# EAGLE schematic V3_slice_noshift (EAGLE 6.5.0)

## Sheet 1 of 6
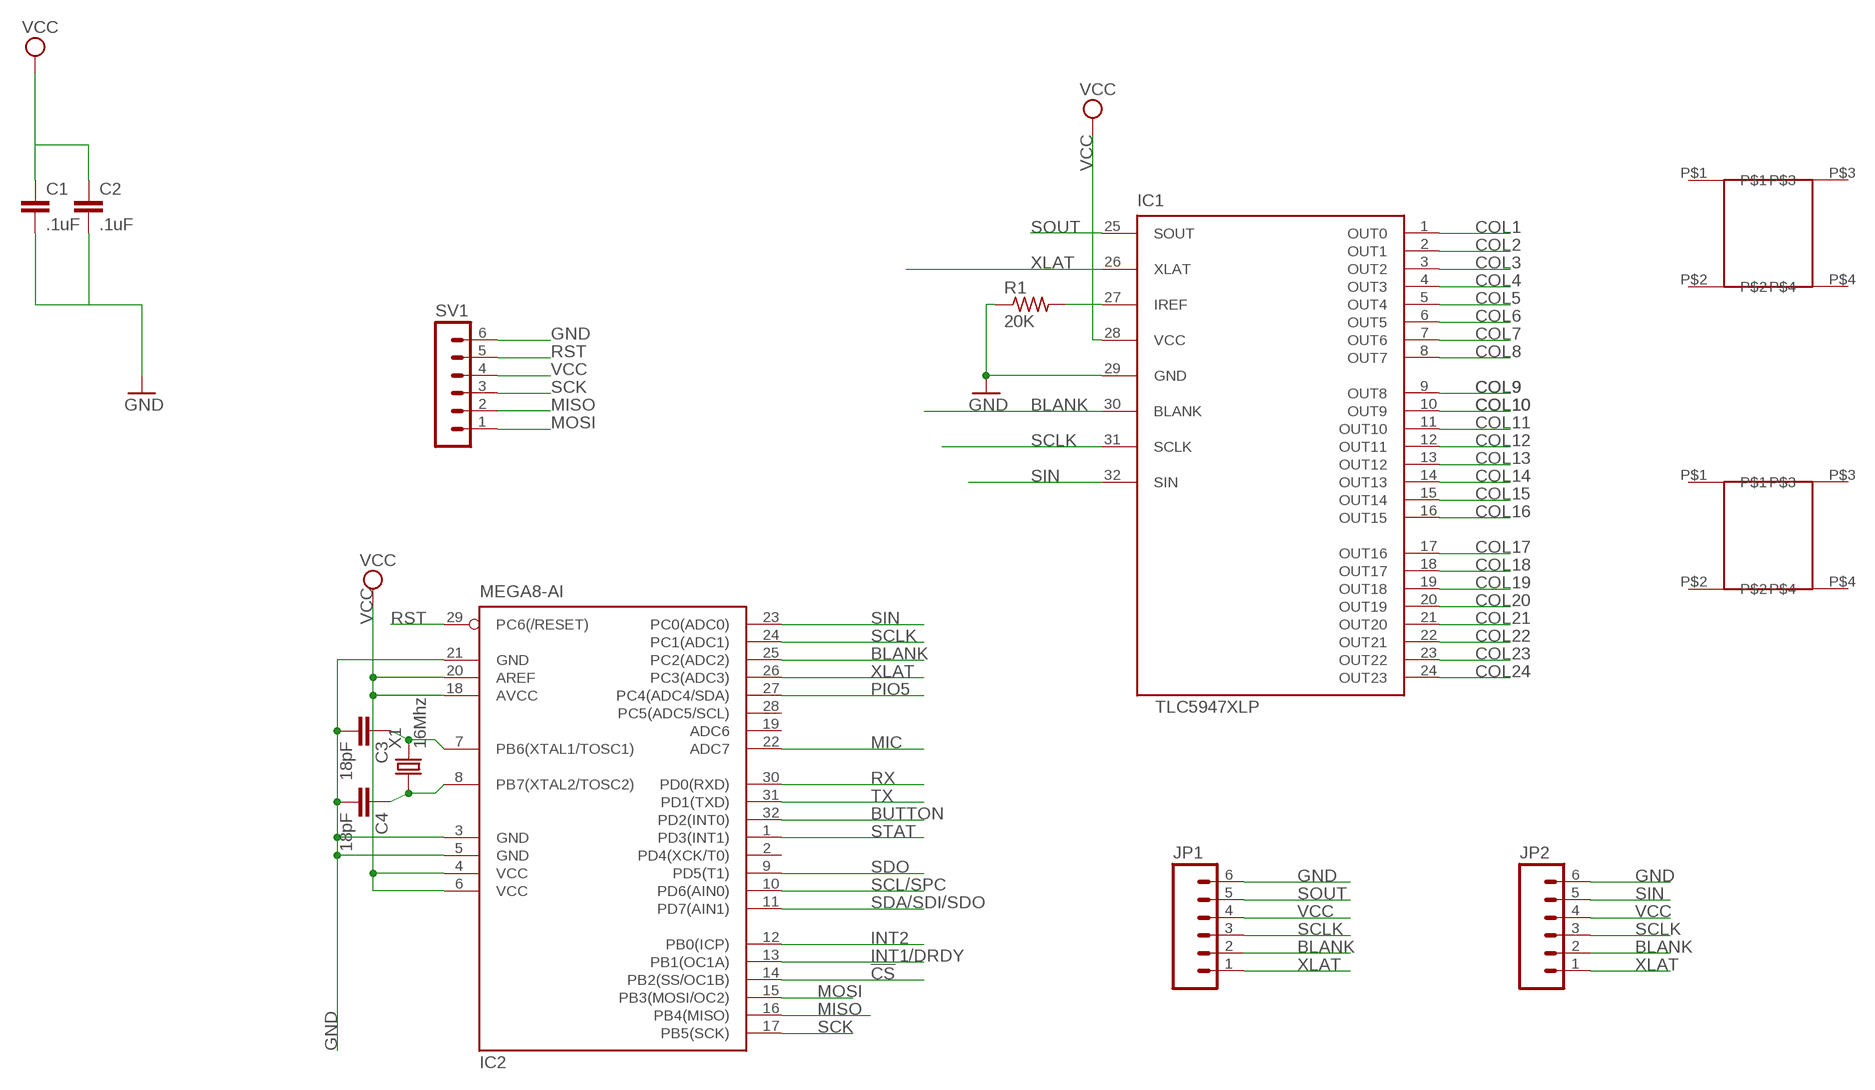
[diagram p0: schematic, sheet 1]

### Parts
C1  .1uF  CAP0805  [0805]
C2  .1uF  CAP0805  [0805]
C3  18pF  CAP0805  [0805]
C4  18pF  CAP0805  [0805]
IC1  TLC5947XLP  [QFN32_XLP]
IC2  MEGA8-AI  [TQFP32-08]
JP1  M061X06-SMD_EDGE_FEMALE  [1X06-SMD_EDGE]
JP2  M061X06-SMD_EDGE_FEMALE  [1X06-SMD_EDGE]
R1  20K  R-US_R0805  [R0805]
SLOT1  SLOT  [SLOT]
SLOT2  SLOT  [SLOT]
SV1  MA06-1  [MA06-1]
X1  16Mhz  CRYSTAL-5032  [5032]

### Nets
!CS: IC2.14(PB2(SS/OC1B)) ; also sheet 3
BLANK: IC1.30(BLANK) IC2.25(PC2(ADC2)) JP1.2 JP2.2
BUTTON: IC2.32(PD2(INT0)) ; also sheet 3
COL1: IC1.1(OUT0) ; also sheet 2
COL2: IC1.2(OUT1) ; also sheet 2
COL3: IC1.3(OUT2) ; also sheet 2
COL4: IC1.4(OUT3) ; also sheet 2
COL5: IC1.5(OUT4) ; also sheet 2
COL6: IC1.6(OUT5) ; also sheet 2
COL7: IC1.7(OUT6) ; also sheet 2
COL8: IC1.8(OUT7) ; also sheet 2
COL9: IC1.9(OUT8) ; also sheet 2
COL10: IC1.10(OUT9) ; also sheet 2
COL11: IC1.11(OUT10) ; also sheet 2
COL12: IC1.12(OUT11) ; also sheet 2
COL13: IC1.13(OUT12) ; also sheet 2
COL14: IC1.14(OUT13) ; also sheet 2
COL15: IC1.15(OUT14) ; also sheet 2
COL16: IC1.16(OUT15) ; also sheet 2
COL17: IC1.17(OUT16) ; also sheet 2
COL18: IC1.18(OUT17) ; also sheet 2
COL19: IC1.19(OUT18) ; also sheet 2
COL20: IC1.20(OUT19) ; also sheet 2
COL21: IC1.21(OUT20) ; also sheet 2
COL22: IC1.22(OUT21) ; also sheet 2
COL23: IC1.23(OUT22) ; also sheet 2
COL24: IC1.24(OUT23) ; also sheet 2
GND: C1.2 C2.2 C3.2 C4.2 IC1.29(GND) IC2.3(GND) IC2.5(GND) IC2.21(GND) JP1.6 JP2.6 R1.1 SV1.6 ; also sheet 3,4,5,6
INT1/DRDY: IC2.13(PB1(OC1A)) ; also sheet 3
INT2: IC2.12(PB0(ICP)) ; also sheet 3
MIC: IC2.22(ADC7) ; also sheet 6
MISO: IC2.16(PB4(MISO)) SV1.2
MOSI: IC2.15(PB3(MOSI/OC2)) SV1.1
N$7: C3.1 IC2.7(PB6(XTAL1/TOSC1)) X1.2
N$8: C4.1 IC2.8(PB7(XTAL2/TOSC2)) X1.1
N$13: IC1.27(IREF) R1.2
PIO5: IC2.27(PC4(ADC4/SDA)) ; also sheet 5
RST: IC2.29(PC6(/RESET)) SV1.5 ; also sheet 3,5
RX: IC2.30(PD0(RXD)) ; also sheet 5
SCK: IC2.17(PB5(SCK)) SV1.3
SCL/SPC: IC2.10(PD6(AIN0)) ; also sheet 3
SCLK: IC1.31(SCLK) IC2.24(PC1(ADC1)) JP1.3 JP2.3
SDA/SDI/SDO: IC2.11(PD7(AIN1)) ; also sheet 3
SDO: IC2.9(PD5(T1)) ; also sheet 3
SIN: IC1.32(SIN) IC2.23(PC0(ADC0)) JP2.5
SOUT: IC1.25(SOUT) JP1.5
STAT: IC2.1(PD3(INT1)) ; also sheet 4
TX: IC2.31(PD1(TXD)) ; also sheet 5
VCC: C1.1 C2.1 IC1.28(VCC) IC2.4(VCC) IC2.6(VCC) IC2.18(AVCC) IC2.20(AREF) JP1.4 JP2.4 SV1.4 ; also sheet 2,3,4,5,6
XLAT: IC1.26(XLAT) IC2.26(PC3(ADC3)) JP1.1 JP2.1
Unconnected: IC2.2(PD4(XCK/T0)) IC2.19(ADC6) IC2.28(PC5(ADC5/SCL)) SLOT1.P$1 SLOT1.P$2 SLOT1.P$3 SLOT1.P$4 SLOT2.P$1 SLOT2.P$2 SLOT2.P$3 SLOT2.P$4

## Sheet 2 of 6
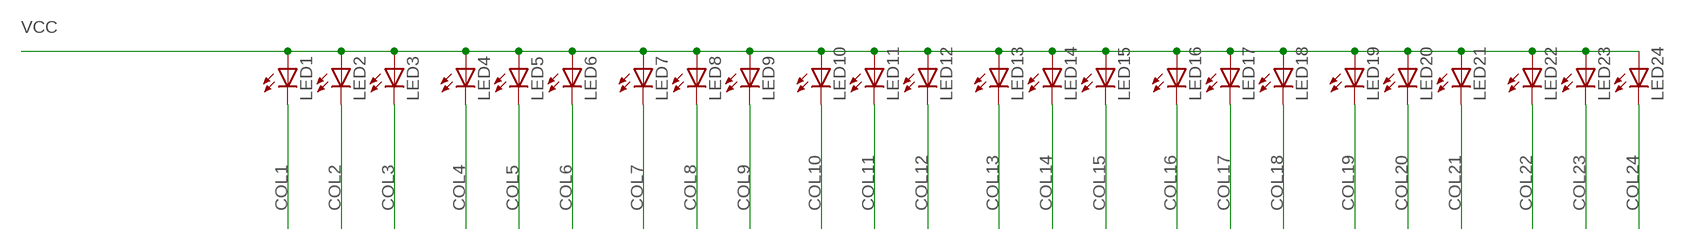
[diagram p1: schematic, sheet 2]

### Parts
LED1  LEDIRL80A  [IRL80A]
LED2  LEDIRL80A  [IRL80A]
LED3  LEDIRL80A  [IRL80A]
LED4  LEDIRL80A  [IRL80A]
LED5  LEDIRL80A  [IRL80A]
LED6  LEDIRL80A  [IRL80A]
LED7  LEDIRL80A  [IRL80A]
LED8  LEDIRL80A  [IRL80A]
LED9  LEDIRL80A  [IRL80A]
LED10  LEDIRL80A  [IRL80A]
LED11  LEDIRL80A  [IRL80A]
LED12  LEDIRL80A  [IRL80A]
LED13  LEDIRL80A  [IRL80A]
LED14  LEDIRL80A  [IRL80A]
LED15  LEDIRL80A  [IRL80A]
LED16  LEDIRL80A  [IRL80A]
LED17  LEDIRL80A  [IRL80A]
LED18  LEDIRL80A  [IRL80A]
LED19  LEDIRL80A  [IRL80A]
LED20  LEDIRL80A  [IRL80A]
LED21  LEDIRL80A  [IRL80A]
LED22  LEDIRL80A  [IRL80A]
LED23  LEDIRL80A  [IRL80A]
LED24  LEDIRL80A  [IRL80A]

### Nets
COL1: LED1.K(C) ; also sheet 1
COL2: LED2.K(C) ; also sheet 1
COL3: LED3.K(C) ; also sheet 1
COL4: LED4.K(C) ; also sheet 1
COL5: LED5.K(C) ; also sheet 1
COL6: LED6.K(C) ; also sheet 1
COL7: LED7.K(C) ; also sheet 1
COL8: LED8.K(C) ; also sheet 1
COL9: LED9.K(C) ; also sheet 1
COL10: LED10.K(C) ; also sheet 1
COL11: LED11.K(C) ; also sheet 1
COL12: LED12.K(C) ; also sheet 1
COL13: LED13.K(C) ; also sheet 1
COL14: LED14.K(C) ; also sheet 1
COL15: LED15.K(C) ; also sheet 1
COL16: LED16.K(C) ; also sheet 1
COL17: LED17.K(C) ; also sheet 1
COL18: LED18.K(C) ; also sheet 1
COL19: LED19.K(C) ; also sheet 1
COL20: LED20.K(C) ; also sheet 1
COL21: LED21.K(C) ; also sheet 1
COL22: LED22.K(C) ; also sheet 1
COL23: LED23.K(C) ; also sheet 1
COL24: LED24.K(C) ; also sheet 1
VCC: LED1.A LED2.A LED3.A LED4.A LED5.A LED6.A LED7.A LED8.A LED9.A LED10.A LED11.A LED12.A LED13.A LED14.A LED15.A LED16.A LED17.A LED18.A LED19.A LED20.A LED21.A LED22.A LED23.A LED24.A ; also sheet 1,3,4,5,6

## Sheet 3 of 6
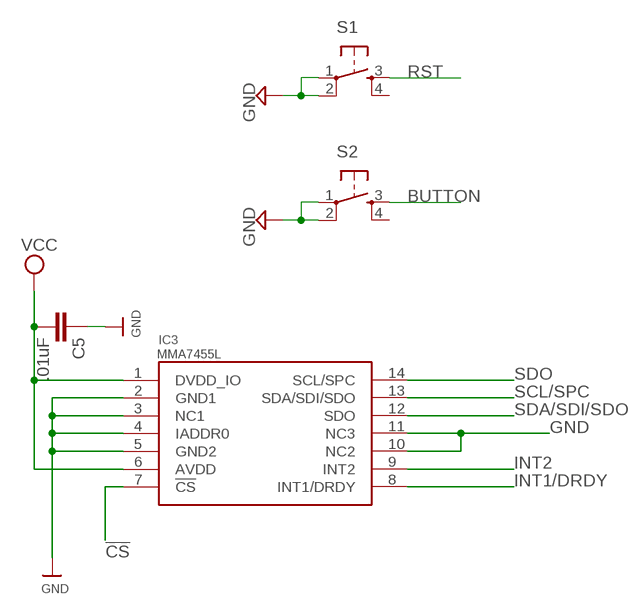
[diagram p2: schematic, sheet 3]

### Parts
C5  .01uF  CAP0805  [0805]
IC3  MMA7455L  [LGA-14]
S1  TAC_SWITCHSMD  [TACTILE_SWITCH_SMD]
S2  TAC_SWITCHSMD  [TACTILE_SWITCH_SMD]

### Nets
!CS: IC3.7(!CS) ; also sheet 1
BUTTON: S2.3 ; also sheet 1
GND: C5.1 IC3.2(GND1) IC3.3(NC1) IC3.4(IADDR0) IC3.5(GND2) IC3.10(NC2) IC3.11(NC3) S1.1 S1.2 S2.1 S2.2 ; also sheet 1,4,5,6
INT1/DRDY: IC3.8(INT1/DRDY) ; also sheet 1
INT2: IC3.9(INT2) ; also sheet 1
RST: S1.3 ; also sheet 1,5
SCL/SPC: IC3.13(SDA/SDI/SDO) ; also sheet 1
SDA/SDI/SDO: IC3.12(SDO) ; also sheet 1
SDO: IC3.14(SCL/SPC) ; also sheet 1
VCC: C5.2 IC3.1(DVDD_IO) IC3.6(AVDD) ; also sheet 1,2,4,5,6
Unconnected: S1.4 S2.4

## Sheet 4 of 6
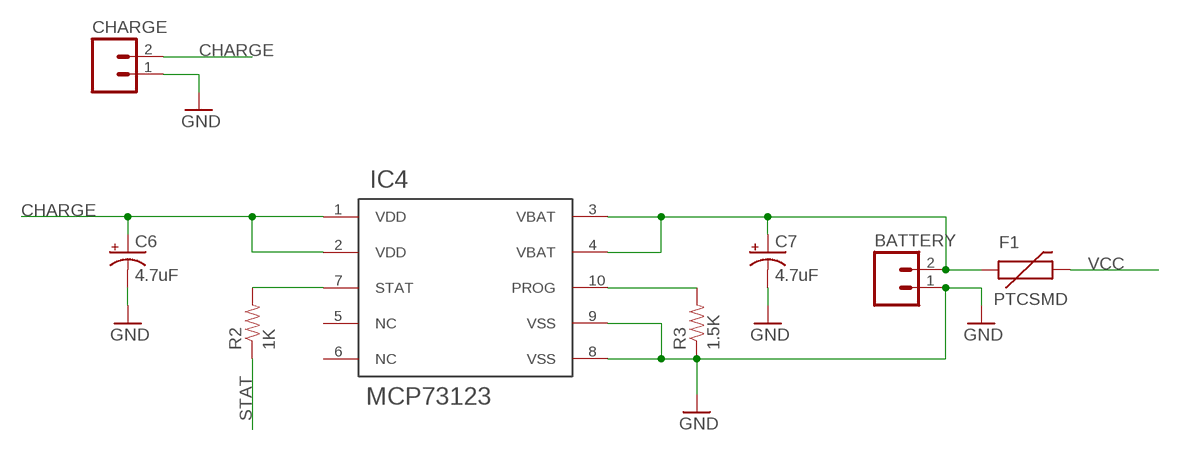
[diagram p3: schematic, sheet 4]

### Parts
BATTERY  M02PTH  [1X02]
C6  4.7uF  CAP_POL3528  [EIA3528]
C7  4.7uF  CAP_POL3528  [EIA3528]
CHARGE  M02-JST-2-PTH-NO_SILK  [JST-2-PTH-NS]
F1  PTCSMD  [PTC-1206]
IC4  MCP73123  [DFN10_3X3]
R2  1K  RESISTOR0805  [0805]
R3  1.5K  RESISTOR0805  [0805]

### Nets
CHARGE: C6.A(+) CHARGE.2 IC4.1(VDD) IC4.2(VDD)
GND: BATTERY.1 C6.C(-) C7.C(-) CHARGE.1 IC4.8(VSS) IC4.9(VSS) R3.1 ; also sheet 1,3,5,6
N$1: IC4.7(STAT) R2.2
N$6: IC4.10(PROG) R3.2
STAT: R2.1 ; also sheet 1
VBAT: BATTERY.2 C7.A(+) F1.1 IC4.3(VBAT) IC4.4(VBAT)
VCC: F1.2 ; also sheet 1,2,3,5,6
Unconnected: IC4.5(NC) IC4.6(NC)

## Sheet 5 of 6
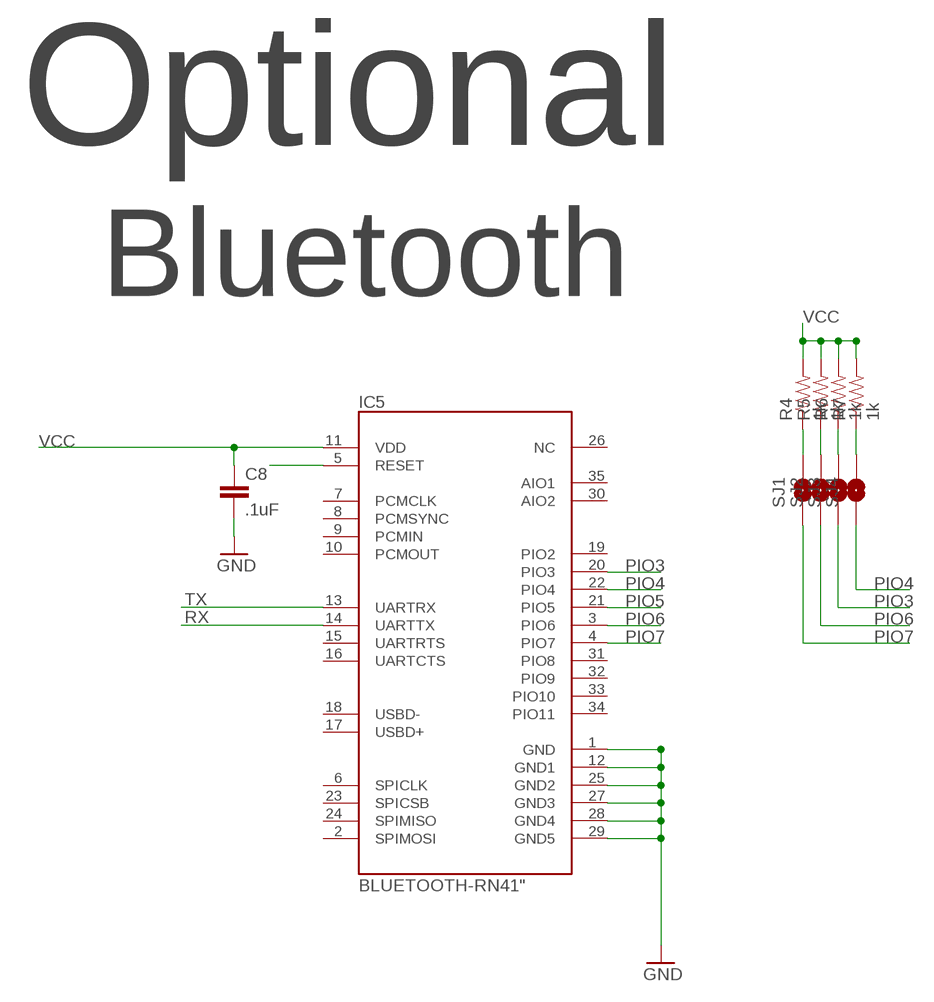
[diagram p4: schematic, sheet 5]

### Parts
C8  .1uF  CAP0805  [0805]
IC5  BLUETOOTH-RN41"  [RN41]
R4  1k  RESISTOR  [0805]
R5  1k  RESISTOR  [0805]
R6  1k  RESISTOR  [0805]
R7  1k  RESISTOR  [0805]
SJ1  SOLDERJUMPERNO  [SJ_2S-NO]
SJ2  SOLDERJUMPERNO  [SJ_2S-NO]
SJ3  SOLDERJUMPERNO  [SJ_2S-NO]
SJ4  SOLDERJUMPERNO  [SJ_2S-NO]

### Nets
GND: C8.2 IC5.1(GND) IC5.12(GND1) IC5.25(GND2) IC5.27(GND3) IC5.28(GND4) IC5.29(GND5) ; also sheet 1,3,4,6
N$5: R4.1 SJ1.2
N$21: R6.1 SJ3.2
N$23: R5.1 SJ2.2
N$24: R7.1 SJ4.2
PIO3: IC5.20(PIO3) SJ3.1
PIO4: IC5.22(PIO4) SJ4.1
PIO5: IC5.21(PIO5) ; also sheet 1
PIO6: IC5.3(PIO6) SJ2.1
PIO7: IC5.4(PIO7) SJ1.1
RST: IC5.5(RESET) ; also sheet 1,3
RX: IC5.14(UARTTX) ; also sheet 1
TX: IC5.13(UARTRX) ; also sheet 1
VCC: C8.1 IC5.11(VDD) R4.2 R5.2 R6.2 R7.2 ; also sheet 1,2,3,4,6
Unconnected: IC5.2(SPIMOSI) IC5.6(SPICLK) IC5.7(PCMCLK) IC5.8(PCMSYNC) IC5.9(PCMIN) IC5.10(PCMOUT) IC5.15(UARTRTS) IC5.16(UARTCTS) IC5.17(USBD+) IC5.18(USBD-) IC5.19(PIO2) IC5.23(SPICSB) IC5.24(SPIMISO) IC5.26(NC) IC5.30(AIO2) IC5.31(PIO8) IC5.32(PIO9) IC5.33(PIO10) IC5.34(PIO11) IC5.35(AIO1)

### Notes on the sheet
- Optional
- Bluetooth

## Sheet 6 of 6
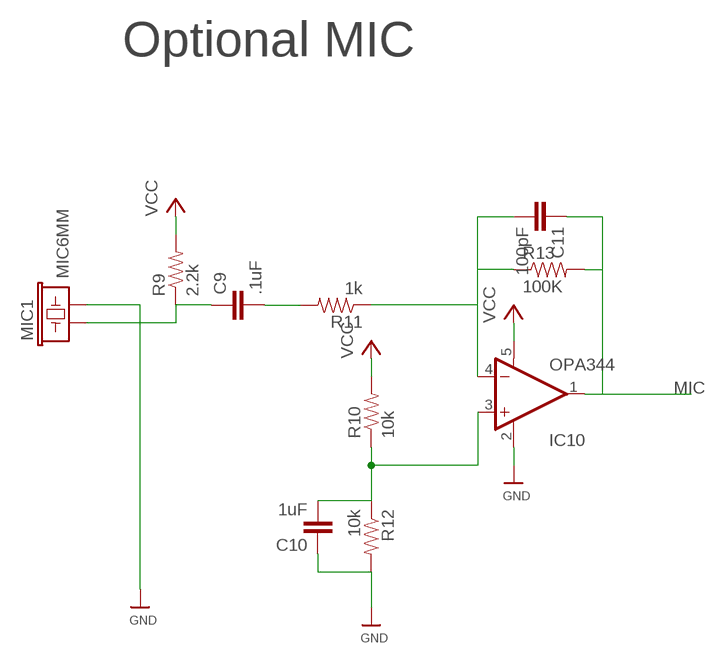
[diagram p5: schematic, sheet 6]

### Parts
C9  .1uF  CAP0805  [0805]
C10  1uF  CAP0805  [0805]
C11  100pF  CAP0805  [0805]
IC10  OPA344  [SOT23-5]
MIC1  MIC6MM  [MIC-6MM]
R9  2.2k  RESISTOR  [0805]
R10  10k  RESISTOR  [0805]
R11  1k  RESISTOR  [0805]
R12  10k  RESISTOR  [0805]
R13  100K  RESISTOR  [0805]

### Nets
GND: C10.1 IC10.2(V-) MIC1.2 R12.2 ; also sheet 1,3,4,5
MIC: C11.1 IC10.1(OUT) R13.2 ; also sheet 1
N$3: C9.2 R11.2
N$10: C11.2 IC10.4(-IN) R11.1 R13.1
N$11: C9.1 MIC1.1 R9.1
N$12: C10.2 IC10.3(+IN) R10.1 R12.1
VCC: IC10.5(V+) R9.2 R10.2 ; also sheet 1,2,3,4,5

### Notes on the sheet
- Optional MIC

## Library data of the parts
BATTERY CHARGE = SparkFun:M02: Header 2 Standard 2-pin 0.1" header. Use with straight break away headers (SKU : PRT-00116), right angle break away headers (PRT-00553), swiss pins (PRT-00743), machine pins (PRT-00117), and female headers (PRT-00115). Molex polarized connector foot print use with SKU : PRT-08233 with associated crimp pins and housings.
C1-C4 = slice_noshift:CAP: Capacitor Standard 0603 ceramic capacitor, and 0.1" leaded capacitor.
C5 C8-C11 = SparkFun:CAP: Capacitor Standard 0603 ceramic capacitor, and 0.1" leaded capacitor.
C6 C7 = slice_noshift:CAP_POL: Capacitor Polarized These are standard SMD and PTH capacitors. Normally 10uF, 47uF, and 100uF in electrolytic and tantalum varieties. Always verify the external diameter of the through hole cap, it varies with capacity, voltage, and manufacturer. The EIA devices should be standard.
F1 = SparkFun:PTC: Resettable Fuse PTC Resettable Fuse. Spark Fun Electronics SKU : COM-08357
IC1 = slice_noshift:TLC5947
IC2 = atmel:MEGA8: MICROCONTROLLER 8 Kbytes FLASH, 1 kbytes SRAM, 512 bytes EEPROM, USART, 6-channel 10 bit ADC, 2-channel 8 bit ADC Pin compatible with Atmega48, ATMega88, ATMega168 Source: avr.lbr; MPN: ATMEGA8-16AU; OC_FARNELL: 9171371; OC_NEWARK: 73M8863
IC3 = MMA7455Lbreakoutboard-v1a:MMA7455L
IC4 = V3_slice_noshift:MCP73123
IC5 = NSL_Mini_Quad:BLUETOOTH-RN41
IC10 = SparkFun:OPA344
JP1 JP2 = SparkFun:M06: Header 6 Standard 6-pin 0.1" header. Use with straight break away headers (SKU : PRT-00116), right angle break away headers (PRT-00553), swiss pins (PRT-00743), machine pins (PRT-00117), and female headers (PRT-00115). Molex polarized connector foot print use with SKU : PRT-08094 with associated crimp pins and housings. NOTES ON THE VARIANTS LOCK and LOCK_LONGPADS... This footprint was designed to help hold the alignment of a through-hole component (i.e. 6-pin header) while soldering it into place. You may notice that each hole has been shifted either up or down by 0.005 of an inch from it's more standard position (which is a perfectly straight line). This slight alteration caused the pins (the squares in the middle) to touch the edges of the holes. Because they are alternating, it causes a "brace" to hold the component in place. 0.005 has proven to be the perfect amount of "off-center" position when using our standard breakaway headers. Although looks a little odd when you look at the bare footprint, once you have a header in there, the alteration is very hard to notice. Also, if you push a header all the way into place, it is covered up entirely on the bottom side. This idea of altering the position of holes to aid alignment will be further integrated into the Sparkfun Library for other footprints. It can help hold any component with 3 or more connection pins.
LED1-LED24 = led:LED: LED OSRAM: - CHIPLED LG R971, LG N971, LY N971, LG Q971, LY Q971, LO R971, LY R971 LH N974, LH R974 LS Q976, LO Q976, LY Q976 LO Q996 - Hyper CHIPLED LW Q18S LB Q993, LB Q99A, LB R99A - SideLED LS A670, LO A670, LY A670, LG A670, LP A670 LB A673, LV A673, LT A673, LW A673 LH A674 LY A675 LS A676, LA A676, LO A676, LY A676, LW A676 LS A679, LY A679, LG A679 - Hyper Micro SIDELED® LS Y876, LA Y876, LO Y876, LY Y876 LT Y87S - SmartLED LW L88C, LW L88S LB L89C, LB L89S, LG L890 LS L89K, LO L89K, LY L89K LS L896, LA L896, LO L896, LY L896 - TOPLED LS T670, LO T670, LY T670, LG T670, LP T670 LSG T670, LSP T670, LSY T670, LOP T670, LYG T670 LG T671, LOG T671, LSG T671 LB T673, LV T673, LT T673, LW T673 LH T674 LS T676, LA T676, LO T676, LY T676, LB T676, LH T676, LSB T676, LW T676 LB T67C, LV T67C, LT T67C, LS T67K, LO T67K, LY T67K, LW E67C LS E67B, LA E67B, LO E67B, LY E67B, LB E67C, LV E67C, LT E67C LW T67C LS T679, LY T679, LG T679 LS T770, LO T770, LY T770, LG T770, LP T770 LB T773, LV T773, LT T773, LW T773 LH T774 LS E675, LA E675, LY E675, LS T675 LS T776, LA T776, LO T776, LY T776, LB T776 LHGB T686 LT T68C, LB T68C - Hyper Mini TOPLED® LB M676 - Mini TOPLED Santana® LG M470 LS M47K, LO M47K, LY M47K Source: http://www.osram.convergy.de LUXEON: - LUMILED® LXK2-PW12-R00, LXK2-PW12-S00, LXK2-PW14-U00, LXK2-PW14-V00 LXK2-PM12-R00, LXK2-PM12-S00, LXK2-PM14-U00 LXK2-PE12-Q00, LXK2-PE12-R00, LXK2-PE12-S00, LXK2-PE14-T00, LXK2-PE14-U00 LXK2-PB12-K00, LXK2-PB12-L00, LXK2-PB12-M00, LXK2-PB14-N00, LXK2-PB14-P00, LXK2-PB14-Q00 LXK2-PR12-L00, LXK2-PR12-M00, LXK2-PR14-Q00, LXK2-PR14-R00 LXK2-PD12-Q00, LXK2-PD12-R00, LXK2-PD12-S00 LXK2-PH12-R00, LXK2-PH12-S00 LXK2-PL12-P00, LXK2-PL12-Q00, LXK2-PL12-R00 Source: www.luxeon.com KINGBRIGHT: KA-3528ASYC Source: www.kingbright.com
MIC1 = slice_noshift:MIC: Microphone Omni-directional electret microphone. 9.7mm standard diameter.
R1 = rcl:R-US_: RESISTOR, American symbol
R2 R3 = slice_noshift:RESISTOR: Resistor Basic schematic elements and footprints for 0603, 1206, and PTH 1/10th watt (small) resistors.
R4-R7 R9-R13 = SparkFun:RESISTOR: Resistor Basic schematic elements and footprints for 0603, 1206, and PTH 1/10th watt (small) resistors.
S1 S2 = SparkFun:TAC_SWITCH: Momentary Switch Button commonly used for reset or general input. Spark Fun Electronics SKU : COM-00097
SJ1-SJ4 = SparkFun:SOLDERJUMPER: Solder Jumper Standard SMD solder jumper. Used to automate production. Two varients : Normally Open and Normally Closed are the same, but have different paste layers. NC will have a large amount of paste and should jumper during reflow.
SLOT1 SLOT2 = slice:SLOT
SV1 = NSL:MA06-1: PIN HEADER
X1 = NSL_MiniQuad:CRYSTAL*: CRYSTAL